# Altium project PDM Mk21.PrjPcb
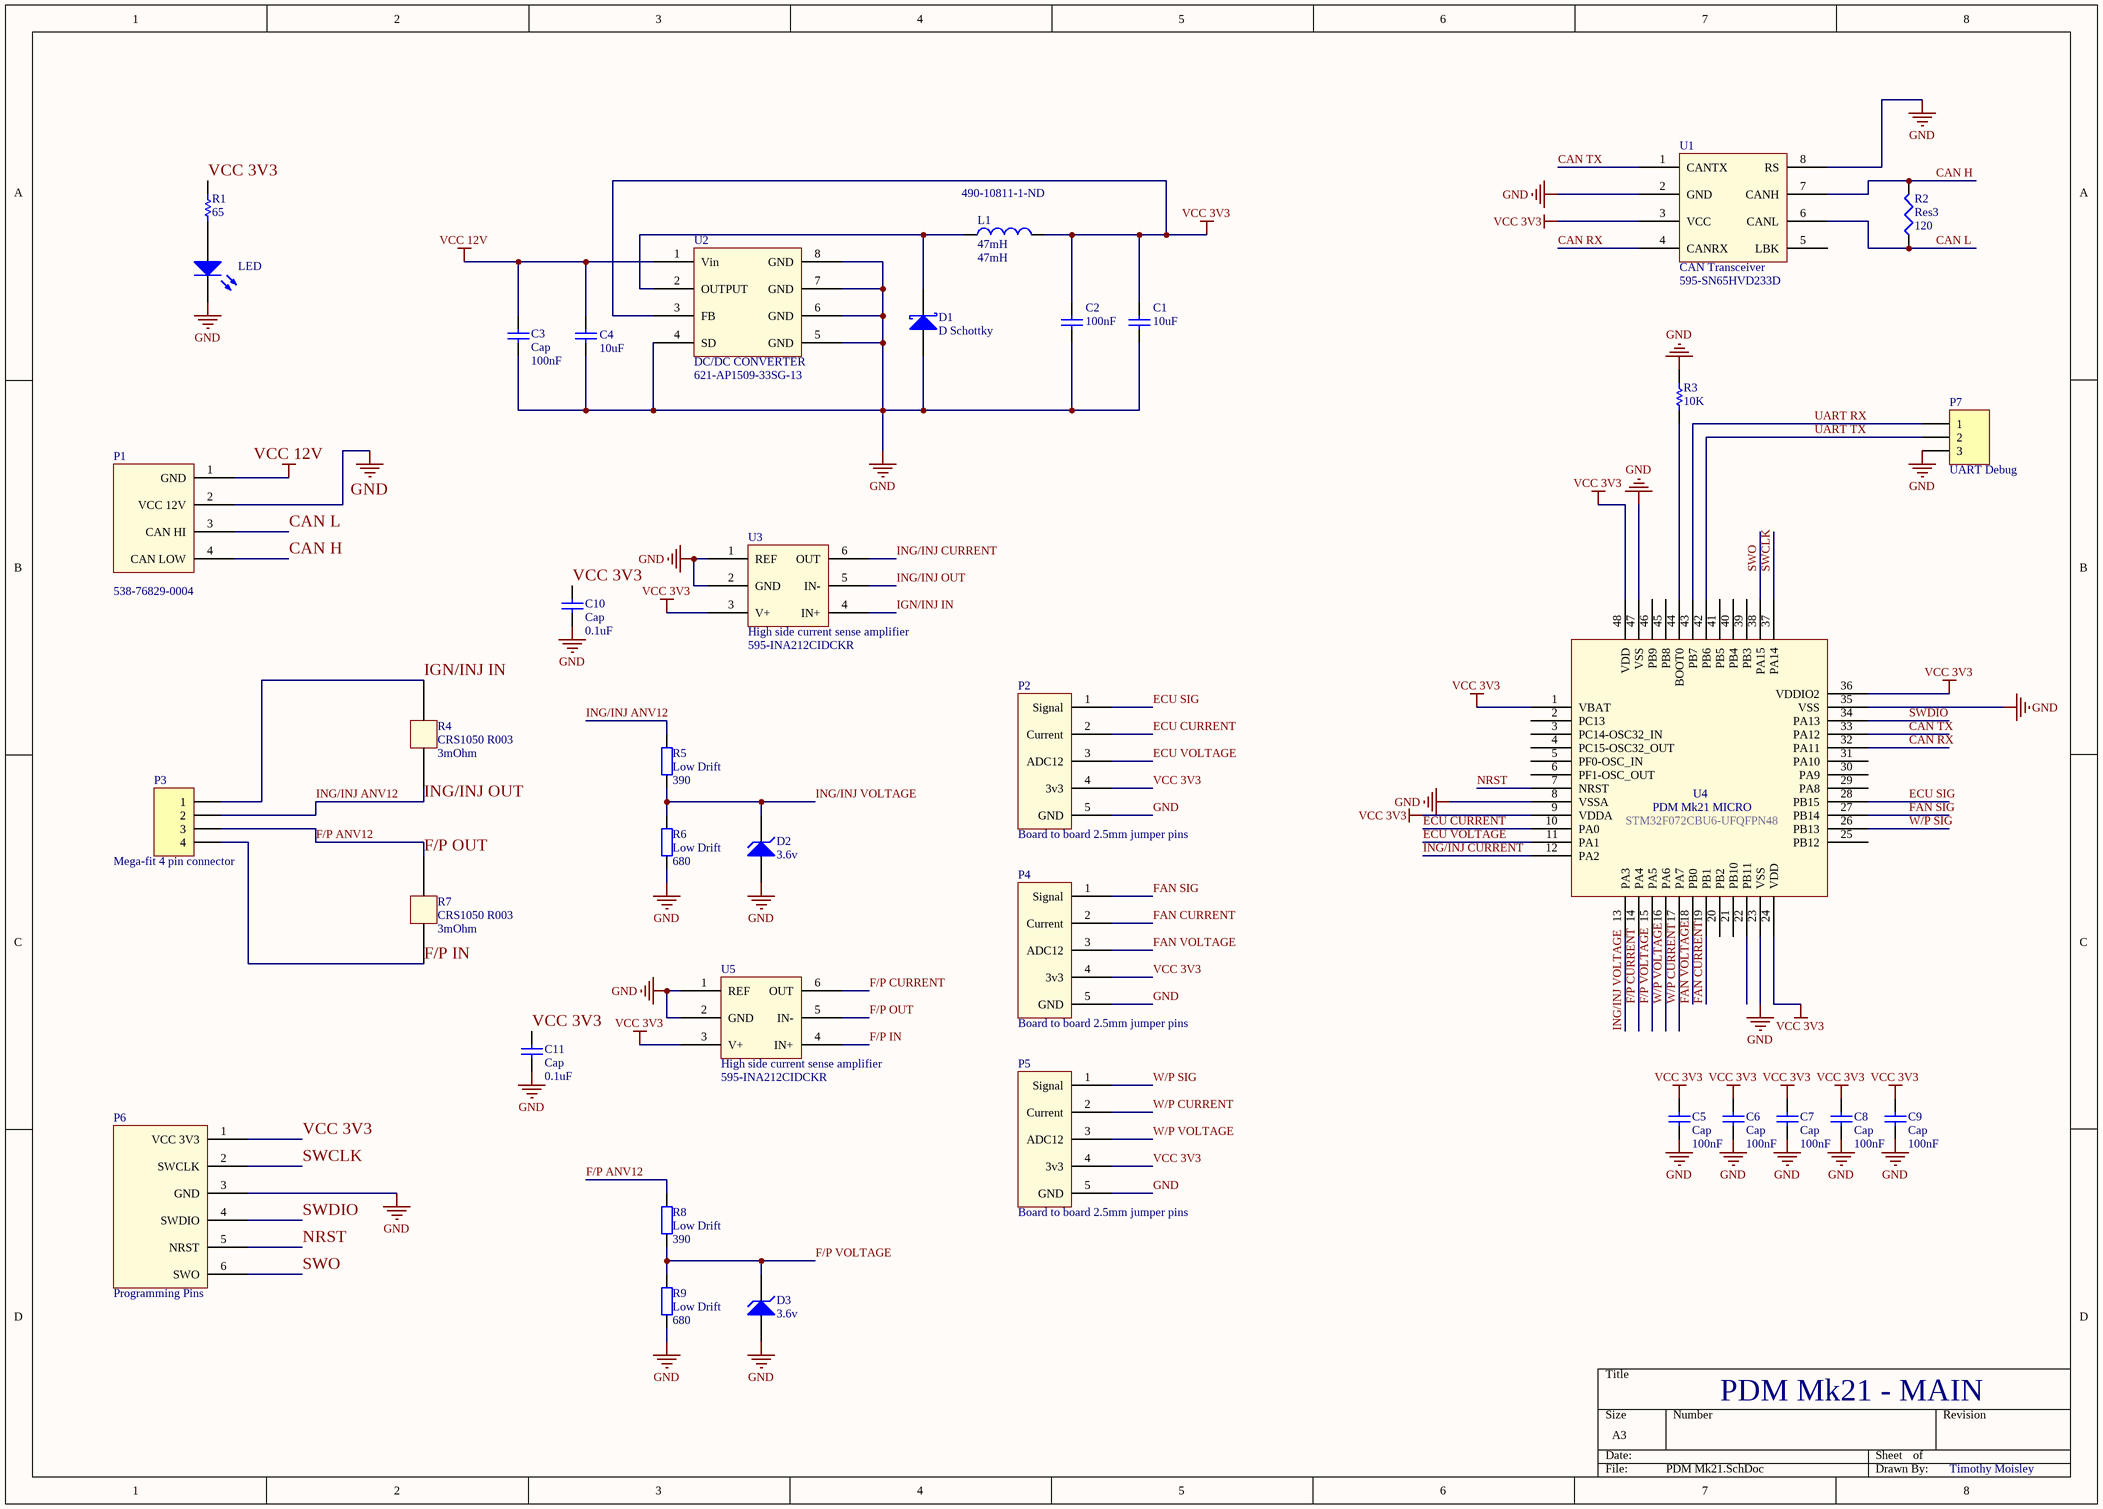
[diagram p0: PDM Mk21.SchDoc]
1 sheet, 37 parts. Net scope: global (net labels, ports and power ports of the same name join across sheets).
Board file: PDM Mk21.PcbDoc

## Sheet PDM Mk21.SchDoc
size A3

### Parts
C1  value 10uF  [SMD CAPACITOR 220UF 16V]
C2  value 100nF  [R0805]
C3  Cap  value 100nF  [R0805]
C4  value 10uF  [SMD CAPACITOR 220UF 16V]
C5  Cap  value 100nF  [R0805]
C6  Cap  value 100nF  [R0805]
C7  Cap  value 100nF  [R0805]
C8  Cap  value 100nF  [R0805]
C9  Cap  value 100nF  [R0805]
C10  Cap  value 0.1uF  [R0805]
C11  Cap  value 0.1uF  [R0805]
D1  D Schottky  [Diode]
D2  3.6v  [BZX84CxxxET1G]
D3  3.6v  [BZX84CxxxET1G]
L1  47mH  Supplier Part Number 2: 490-10811-1-ND  [Inductor]
LED  (no value)  [LED-0]
P1  Supplier Part No.: 538-76829-0004  [SMD 4Wire]  (hidden comment: Mega-fit 4 pin connector)
P2  Board to board 2.5mm jumper pins  [Board-Board Jumper]
P3  Mega-fit 4 pin connector  [Mega-fit 4 pin connector]
P4  Board to board 2.5mm jumper pins  [Board-Board Jumper]
P5  Board to board 2.5mm jumper pins  [Board-Board Jumper]
P6  Programming Pins  [Programming Pins]
P7  UART Debug  [HDR1X3]
R1  value 65  [R0805]  (hidden comment: GND)
R2  Res3  value 120  [J1-0603]
R3  value 10K  [R0805]  (hidden comment: GND)
R4  CRS1050 R003  value 3mOhm  [CRS1050]
R5  Low Drift  value 390  [R0805]
R6  Low Drift  value 680  [R0805]
R7  CRS1050 R003  value 3mOhm  [CRS1050]
R8  Low Drift  value 390  [R0805]
R9  Low Drift  value 680  [R0805]
U1  CAN Transceiver  [CAN Transceiver]
U2  DC/DC CONVERTER  Supplier Part Number: 621-AP1509-33SG-13  [DC/DC Converter]
U3  High side current sense amplifier  Supplier Part Number: 595-INA212CIDCKR  [INA212]
U4  PDM Mk21 MICRO  Part Number: STM32F072CBU6-UFQFPN48  [QFN50P700X700X60_HS-49N]
U5  High side current sense amplifier  Supplier Part Number: 595-INA212CIDCKR  [INA212]

### Nets
GND: C1.1 C2.1 C3.2 C4.2 C5.1 C6.1 C7.1 C8.1 C9.1 C10.1 C11.1 D1.1(A) D2.1(A) D3.1(A) LED.2(K) P1.2(VCC_12V) P2.5(GND) P4.5(GND) P5.5(GND) P6.3(GND) P7.3 R3.2 R6.1 R9.1 U1.2(GND) U1.8(RS) U2.4(SD) U2.5(GND) U2.6(GND) U2.7(GND) U2.8(GND) U3.1(REF) U3.2(GND) U4.8(VSSA) U4.23(VSS) U4.35(VSS) U4.47(VSS) U5.1(REF) U5.2(GND)
VCC 3V3: C1.2 C2.2 C5.2 C6.2 C7.2 C8.2 C9.2 C10.2 C11.2 L1.2 P2.4(3v3) P4.4(3v3) P5.4(3v3) P6.1(VCC_3V3) R1.1 U1.3(VCC) U2.3(FB) U3.3(V+) U4.1(VBAT) U4.9(VDDA) U4.24(VDD) U4.36(VDDIO2) U4.48(VDD) U5.3(V+)
VCC 12V: C3.1 C4.1 P1.1(GND) U2.1(Vin)
CAN H: P1.4(CAN_LOW) R2.2 U1.7(CANH)
CAN L: P1.3(CAN_HI) R2.1 U1.6(CANL)
CAN RX: U1.4(CANRX) U4.32(PA11)
CAN TX: U1.1(CANTX) U4.33(PA12)
ECU CURRENT: P2.2(Current) U4.10(PA0)
ECU SIG: P2.1(Signal) U4.28(PB15)
ECU VOLTAGE: P2.3(ADC12) U4.11(PA1)
F/P ANV12: P3.3 R7.2 R8.2 U5.5(IN-)  [also labelled F/P OUT]
F/P CURRENT: U4.14(PA4) U5.6(OUT)
F/P IN: P3.4 R7.1 U5.4(IN+)
F/P VOLTAGE: D3.2(K) R8.1 R9.2 U4.15(PA5)
FAN CURRENT: P4.2(Current) U4.19(PB1)
FAN SIG: P4.1(Signal) U4.27(PB14)
FAN VOLTAGE: P4.3(ADC12) U4.18(PB0)
IGN/INJ IN: P3.1 R4.1 U3.4(IN+)
ING/INJ ANV12: P3.2 R4.2 R5.2 U3.5(IN-)  [also labelled ING/INJ OUT]
ING/INJ CURRENT: U3.6(OUT) U4.12(PA2)
ING/INJ VOLTAGE: D2.2(K) R5.1 R6.2 U4.13(PA3)
NRST: P6.5(NRST) U4.7(NRST)
SWCLK: P6.2(SWCLK) U4.37(PA14)
SWDIO: P6.4(SWDIO) U4.34(PA13)
SWO: P6.6(SWO) U4.38(PA15)
UART RX: P7.1 U4.43(PB7)
UART TX: P7.2 U4.42(PB6)
W/P CURRENT: P5.2(Current) U4.17(PA7)
W/P SIG: P5.1(Signal) U4.26(PB13)
W/P VOLTAGE: P5.3(ADC12) U4.16(PA6)
NetD1_2: D1.2(K) L1.1 U2.2(OUTPUT)
NetLED_1: LED.1(A) R1.2
NetR3_1: R3.1 U4.44(BOOT0)

Not connected (* = marked no-connect by the designer): U1 5(LBK); U4 2(PC13) 3(PC14-OSC32_IN) 4(PC15-OSC32_OUT) 5(PF0-OSC_IN) 6(PF1-OSC_OUT) 20(PB2) 21(PB10) 22(PB11) 25(PB12) 29(PA8) 30(PA9) 31(PA10) 39(PB3) 40(PB4) 41(PB5) 45(PB8) 46(PB9)

### Notes on the sheet
- PDM Mk21 - MAIN
- Timothy Moisley

### Library data of the parts
C1 C2 C4 = Cap Semi: Capacitor (Semiconductor SIM Model); Published: 8-Jun-2000; LatestRevisionDate: 29-May-2009; LatestRevisionNote: IPC-7351 Footprint Added.; PackageReference: C1206; Publisher: Altium Limited; PackageDescription: Chip Capacitor
C3 C5-C11 = Cap: Capacitor; Published: 8-Jun-2000; LatestRevisionDate: 17-Jul-2002; LatestRevisionNote: Re-released for DXP Platform.; PackageReference: RAD-0.3; Publisher: Altium Limited; PackageDescription: Radial Cap, Thru-Hole; 2 Leads; 0.3 in Pin Spacing
D1 = D Schottky: Schottky Diode; Published: 8-Jun-2000; LatestRevisionDate: 17-Jul-2002; LatestRevisionNote: Re-released for DXP Platform.; PackageReference: SMB; Publisher: Altium Limited; PackageDescription: DO-214-AA/SMB; 2 C-Bend Leads; Body 5.3 x 3.6 mm, inc. leads (LxW); Code_JEDEC: DO-214-AA
D2 D3 = D Zener: Zener Diode; Published: 8-Jun-2000; LatestRevisionDate: 17-Jul-2002; LatestRevisionNote: Re-released for DXP Platform.; PackageReference: DIODE-0.7; Publisher: Altium Limited; PackageDescription: Diode, Thru-Hole; 2 Leads; 0.7 in Pin Spacing
L1 = Inductor: Manufacturer: Murata - TOKO; Manufacturer Part Number: 1255AY-470M=P3; Code_IEC: 1005; Core Material: Ferrite; Inductance: 47 uH; Maximum DC Current: 1.4 A; Maximum DC Resistance: 252 mOhms; Shielding: Shielded; Tolerance: 20 %; Type: Ferrite Inductor; Test Frequency: 100 kHz; Product Status: New Product; Current Rating: 1.4A; DC Resistance (DCR): 252 mOhm Max; Frequency - Test: 100kHz; Published: 8-Jun-2000; LatestRevisionDate: 29-May-2009; LatestRevisionNote: IPC-7351 Footprint Added.; PackageReference: 0402-A; Publisher: Altium Limited; PackageDescription: Chip Inductor; Code_JEITA: 0402; Value: 47mH; Supplier 1: Mouser; RoHS: RoHS Compliant; Category: Fixed Inductors; Stock 1: 1938; Pricing 1: 1=0.752, 10=0.547, 100=0.387, 1500=0.286, 3000=0.261, 9000=0.253, 24000=0.245, 49500=0.235 (AUD); Height: 4.5 mm; Length: 6.3 mm; Packaging: Reel; Product: Inductors; Series: DG6045C; Termination Style: SMD/SMT; Width: 6.3 mm; Brand: Murata - TOKO; Mounting Style: SMD/SMT; RoHS - Mouser: Y; Minimum Order Quantity: 1; Reeling: True; ComponentLink1URL: http://www.mouser.com/ds/2/281/m_dg6045c-610991.pdf; ComponentLink1Description: http://www.mouser.com/ds/2/281/m_dg6045c-610991.pdf; Supplier 2: Digi-Key; Stock 2: 3431; Pricing 2: 1=0.67, 10=0.598, 25=0.5608, 50=0.4862, 100=0.4488, 250=0.42636, 500=0.38898, 750=0.34409 (AUD); Material - Core: Ferrite; Current - Saturation: -; Q @ Freq: -; Frequency - Self Resonant: -; Ratings: -; Operating Temperature: -; Mounting Type: Surface Mount; Package / Case: Nonstandard; Size / Dimension: 0.248" L x 0.248" W (6.30mm x 6.30mm); Height - Seated (Max): 0.177" (4.50mm); ComponentLink2URL: http://www.toko.co.jp/products-murata/pdf/inductors/m_dg6045c.pdf; ComponentLink2Description: http://www.toko.co.jp/products-murata/pdf/inductors/m_dg6045c.pdf
LED = LED0: Typical INFRARED GaAs LED; Published: 8-Jun-2000; LatestRevisionDate: 08-Jul-2005; LatestRevisionNote: Mech Layer 1 removed.; PackageReference: LED-0; Publisher: Altium Limited; PackageDescription: LED; 2 Leads
P1 = Mega-fit 4 pin connector: MOLEX mega-fit 4 pin connector; Manufacturer Part No.: 76829-0004; Manufacturer: MOLEX; Supplier: Mouser
P2 P4 P5 = Board-Board Jumper
P3 = Header 4: Header, 4-Pin; LatestRevisionDate: 17-Jul-2002; LatestRevisionNote: Re-released for DXP Platform.; Publisher: Altium Limited
P6 = Programming Pins: STM32 micro programming pins
P7 = Header 3: Header, 3-Pin; LatestRevisionDate: 17-Jul-2002; LatestRevisionNote: Re-released for DXP Platform.; Publisher: Altium Limited
R1 R3 = Res1: Resistor; Published: 8-Jun-2000; LatestRevisionDate: 17-Jul-2002; LatestRevisionNote: Re-released for DXP Platform.; PackageReference: AXIAL-0.3; Publisher: Altium Limited; PackageDescription: Axial Device, Thru-Hole; 2 Leads; 0.3 in Pin Spacing
R2 = Res3: Resistor; Published: 8-Jun-2000; LatestRevisionDate: 29-May-2009; LatestRevisionNote: IPC-7351 Footprint Added.; PackageReference: J1-0603; Publisher: Altium Limited; PackageDescription: Chip Resistor
R4 R7 = CSR1050: Current Shunt Resistor; Maunfacturer: Arcol; Supplier: Mouser; Supplier Part no.: 284-CRS1050R003J100T; Manufacturer part no.: CRS1050 R003
R5 R6 R8 R9 = Res2: Resistor; Published: 8-Jun-2000; LatestRevisionDate: 17-Jul-2002; LatestRevisionNote: Re-released for DXP Platform.; PackageReference: AXIAL-0.4; Publisher: Altium Limited; PackageDescription: Axial Device, Thru-Hole; 2 Leads; 0.4 in Pin Spacing
U1 = 595-SN65HVD233D: Supplier: Mouser; Supplier Part No.: 595-SN65HVD233D
U2 = AP1509-33SG-13: Supplier: Mouser
U3 U5 = INA212: Manufacturer: Texas Instruments; Manufacturer part no.: INA212CIDCKR; Supplier: Mouser
U4 = STM32F072CBU6: Manufacturer: ST Microelectrics; Supplier: RS Components